# Altium schematic sheet Power Management.SchDoc
size A4
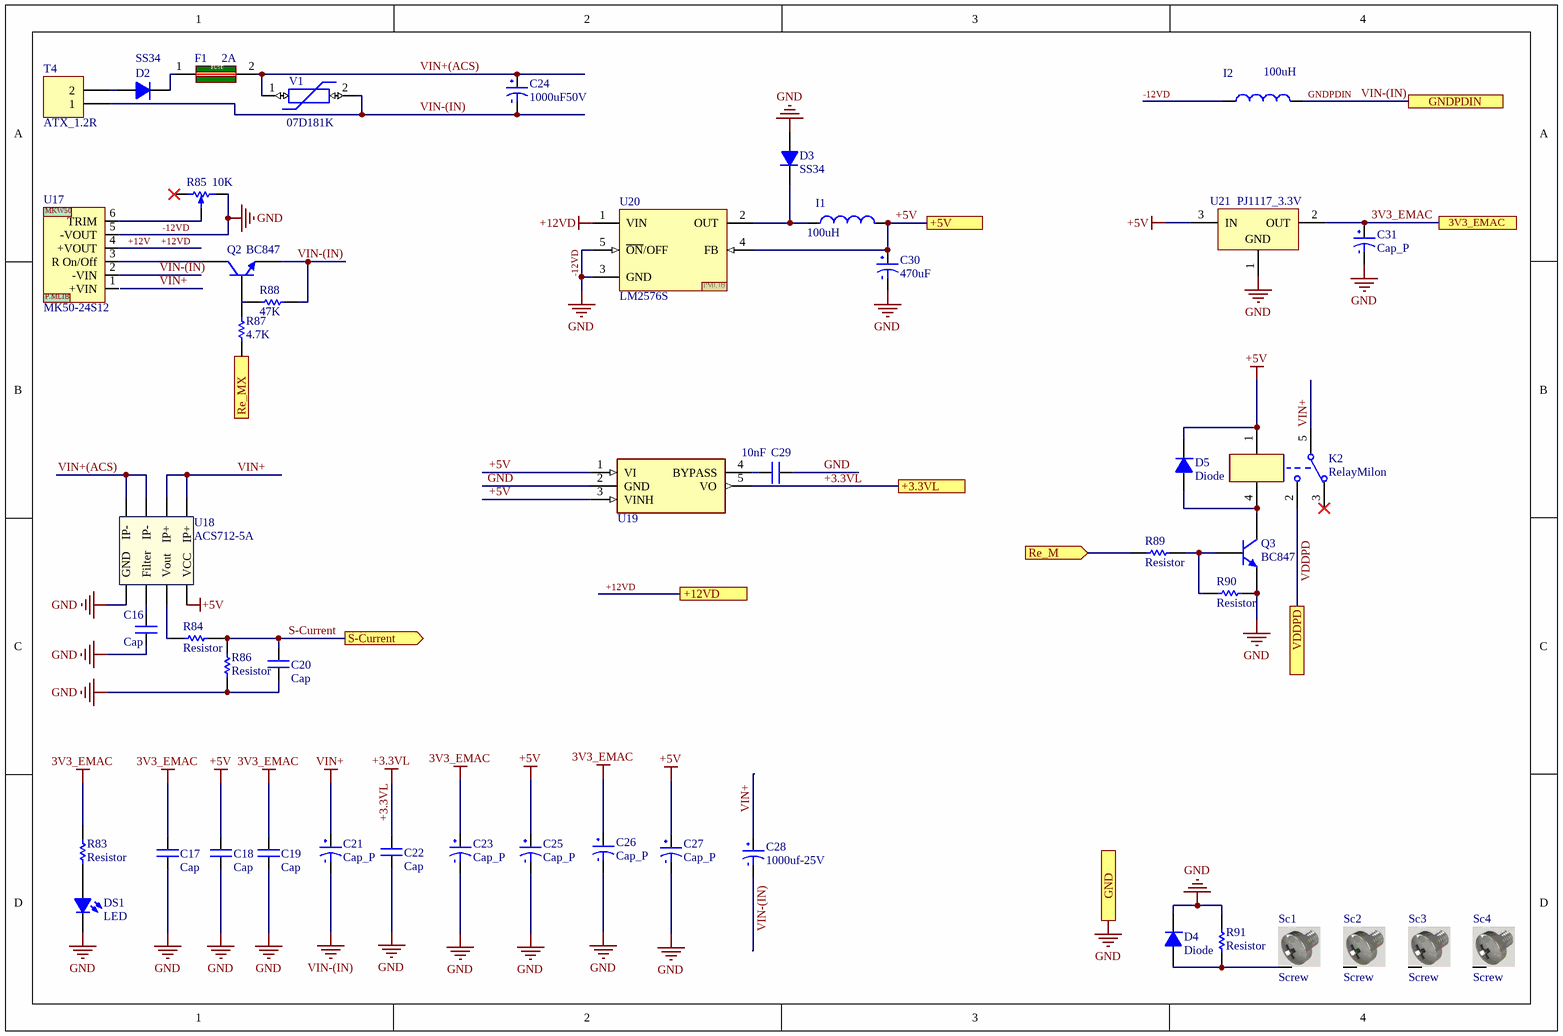
[diagram p0: Power Management.SchDoc]

## Parts
C16  Cap  [Cap0805]
C17  Cap  [Cap0805]
C18  Cap  [Cap0805]
C19  Cap  [Cap0805]
C20  Cap  [Cap0805]
C21  Cap_P  [Cap_5mm]
C22  Cap  [Cap0805]
C23  Cap_P  [CAPMOL_C]
C24  1000uF50V  [Cap_8mm]
C25  Cap_P  [CAPMOL_C]
C26  Cap_P  [CAPMOL_C]
C27  Cap_P  [Cap_SMD]
C28  1000uf-25V  [Cap_5mm]
C29  10nF  [Cap0805]
C30  470uF  [Cap_4mm]
C31  Cap_P  [Cap_4mm]
D2  SS34  [Diod-1A-SMD]
D3  SS34  [Diod-1A-SMD]
D4  Diode  [Diod-1A-SMD]
D5  Diode  [Diod-1A-SMD]
DS1  LED  [Led0805]
F1  2A  [1206]
I1  100uH  [Indicator_SMD]
I2  100uH  [Indicator_10mH]
K2  RelayMilon  [RelayMinionSmall]
Q2  BC847  [SOT23_BEC_L]
Q3  BC847  [SOT23_BEC_L]
R83  Resistor  [R0805]
R84  Resistor  [R0805]
R85  value 10K  [POT4MM-Small Pot]  (hidden comment: RPot SM)
R86  Resistor  [R0805]
R87  4.7K  [R0805]
R88  47K  [R0805]
R89  Resistor  [R0805]
R90  Resistor  [R0805]
R91  Resistor  [0603]
Sc1  Screw  [Screw]
Sc2  Screw  [Screw]
Sc3  Screw  [Screw]
Sc4  Screw  [Screw]
T4  ATX_1.2R  [ATX_1.2S]
U17  MK50-24S12  [MK50]
U18  ACS712-5A  [SOP8]
U19  LD3985M33R  [SOT95P280X110-5N]  (value not drawn)
U20  LM2576S  [LM2576S]
U21  PJ1117_3.3V  [PJ1117s]
V1  07D181K  [MOV-7D]

## Ports
3V3_EMAC, +3.3VL, +5V, +12VD, GND, GNDPDIN, Re_M (in), Re_MX (in), S-Current (out), VDDPD

## Nets
3V3_EMAC: C17.2 C19.2 C23.2 C26.2 C31.2 R83.1 U21.2(OUT) ; port 3V3_EMAC
+3.3VL: C22.2 U19.5(VO) ; port +3.3VL
+5V: C18.2 C25.2 C27.2 C30.2 D5.K I1.2 K2.1 U18.8(VCC) U19.1(VI) U19.3(VINH) U20.4(FB) U21.3(IN) ; port +5V
+12V: U17.4(+VOUT) U20.1(VIN) ; port +12VD  [also labelled +12VD]
-12VD: C16.1 C17.1 C18.1 C19.1 C20.1 C22.1 C23.1 C25.1 C26.1 C27.1 C29.2 C30.1 C31.1 D3.A D4.K DS1.K I2.1 Q3.2(E) R85.CW(+) R86.2 R90.1 R91.1 U17.5(-VOUT) U18.5(GND) U19.2(GND) U20.3(GND) U20.5(~{ON}/OFF) U21.1(GND) ; port GND  [also labelled GND]
GNDPDIN: C21.1 C24.1 C28.1 I2.2 Q2.2(E) R88.1 T4.1 U17.2(-VIN) V1.2 ; port GNDPDIN  [also labelled VIN-(IN)]
VIN+: C21.2 C28.2 K2.5 U18.1(IP+) U18.2(IP+)
Re_M: R89.2 ; port Re_M
Re_MX: R87.2 ; port Re_MX
S-Current: C20.2 R84.1 R86.1 ; port S-Current
VDDPD: K2.2 ; port VDDPD
VIN+(ACS): C24.2 F1.2(OUT) U18.3(IP-) U18.4(IP-) V1.1
NetC16_2: C16.2 U18.6(Filter)
NetC29_1: C29.1 U19.4(BYPASS)
NetD2_A: D2.A T4.2
NetD2_K: D2.K F1.1(IN)
NetD3_K: D3.K I1.1 U20.2(OUT)
NetD4_A: D4.A R91.2 Sc1.S
NetD5_A: D5.A K2.4 Q3.3(C)
NetDS1_A: DS1.A R83.2
NetQ2_1: Q2.1(B) R87.1 R88.2
NetQ2_3: Q2.3(C) U17.3(R_On/Off)
NetQ3_1: Q3.1(B) R89.1 R90.2
NetR84_2: R84.2 U18.7(Vout)
NetR85_W: R85.W U17.6(TRIM)

Not connected (* = marked no-connect by the designer): K2 3*; R85 CCW(-)*; Sc2 S; Sc3 S; Sc4 S; U17 1(+VIN)

## Notes on the sheet
- Title
- Size:
- Data:
- CompanyName:
- A4
- Number:
- Time:
- Revision:
- Engineer:
- File:
- (in symbol Fuse) FUSE
- (in symbol LM2576S) PMLIB
- (in symbol MK50) MKW50; P.MLIB

## Library data of the parts
C16-C20 C22 C29 = Cap: Surface mount Capacitor
C21 C23-C28 C30 C31 = Cap_P: Polarity
D2 D3 = Diode
F1 = Fuse
I1 I2 = Inductor: Indicator
Q2 Q3 = NPN: NPN Bipolar Transistor; Published: 8-Jun-2000; LatestRevisionDate: 29-May-2009; LatestRevisionNote: IPC-7351 Footprint Added.; PackageVersion: Aug-1999; PackageReference: SOT-23B; Publisher: Altium Limited; PackageDescription: 3-Pin SOT-23 Package 0.95 mm Pitch, 2.4 mm Lead Span
R85 = RPot SM: Square Trimming Potentiometer; Published: 17-Dec-2003; DatasheetVersion: Oct-2003; PackageReference: POT4MM-2; Publisher: Altium Limited; PackageDescription: Square Trimming Potentiometer; ComponentLink1Description: Manufacturer Link; ComponentLink1URL: http://bourns.com/2/search.html
R87 R88 = Resistor
Sc1-Sc4 = Screw: Screw 3mm
T4 = ATX_1.2R: Connector
U17 = MK50: DCtoDC
U18 = ACS712: Hall effect Current Sensor
U19 = LD3985M33R: Linear Voltage Regulator IC 1 Output 150mA
U20 = LM2576S: Regulator
U21 = PJ1117_3.3V: Regulator
V1 = MOV-07D: 07D181K = 26V